# EAGLE design Crumar_D9U_Main (EAGLE 6.4)
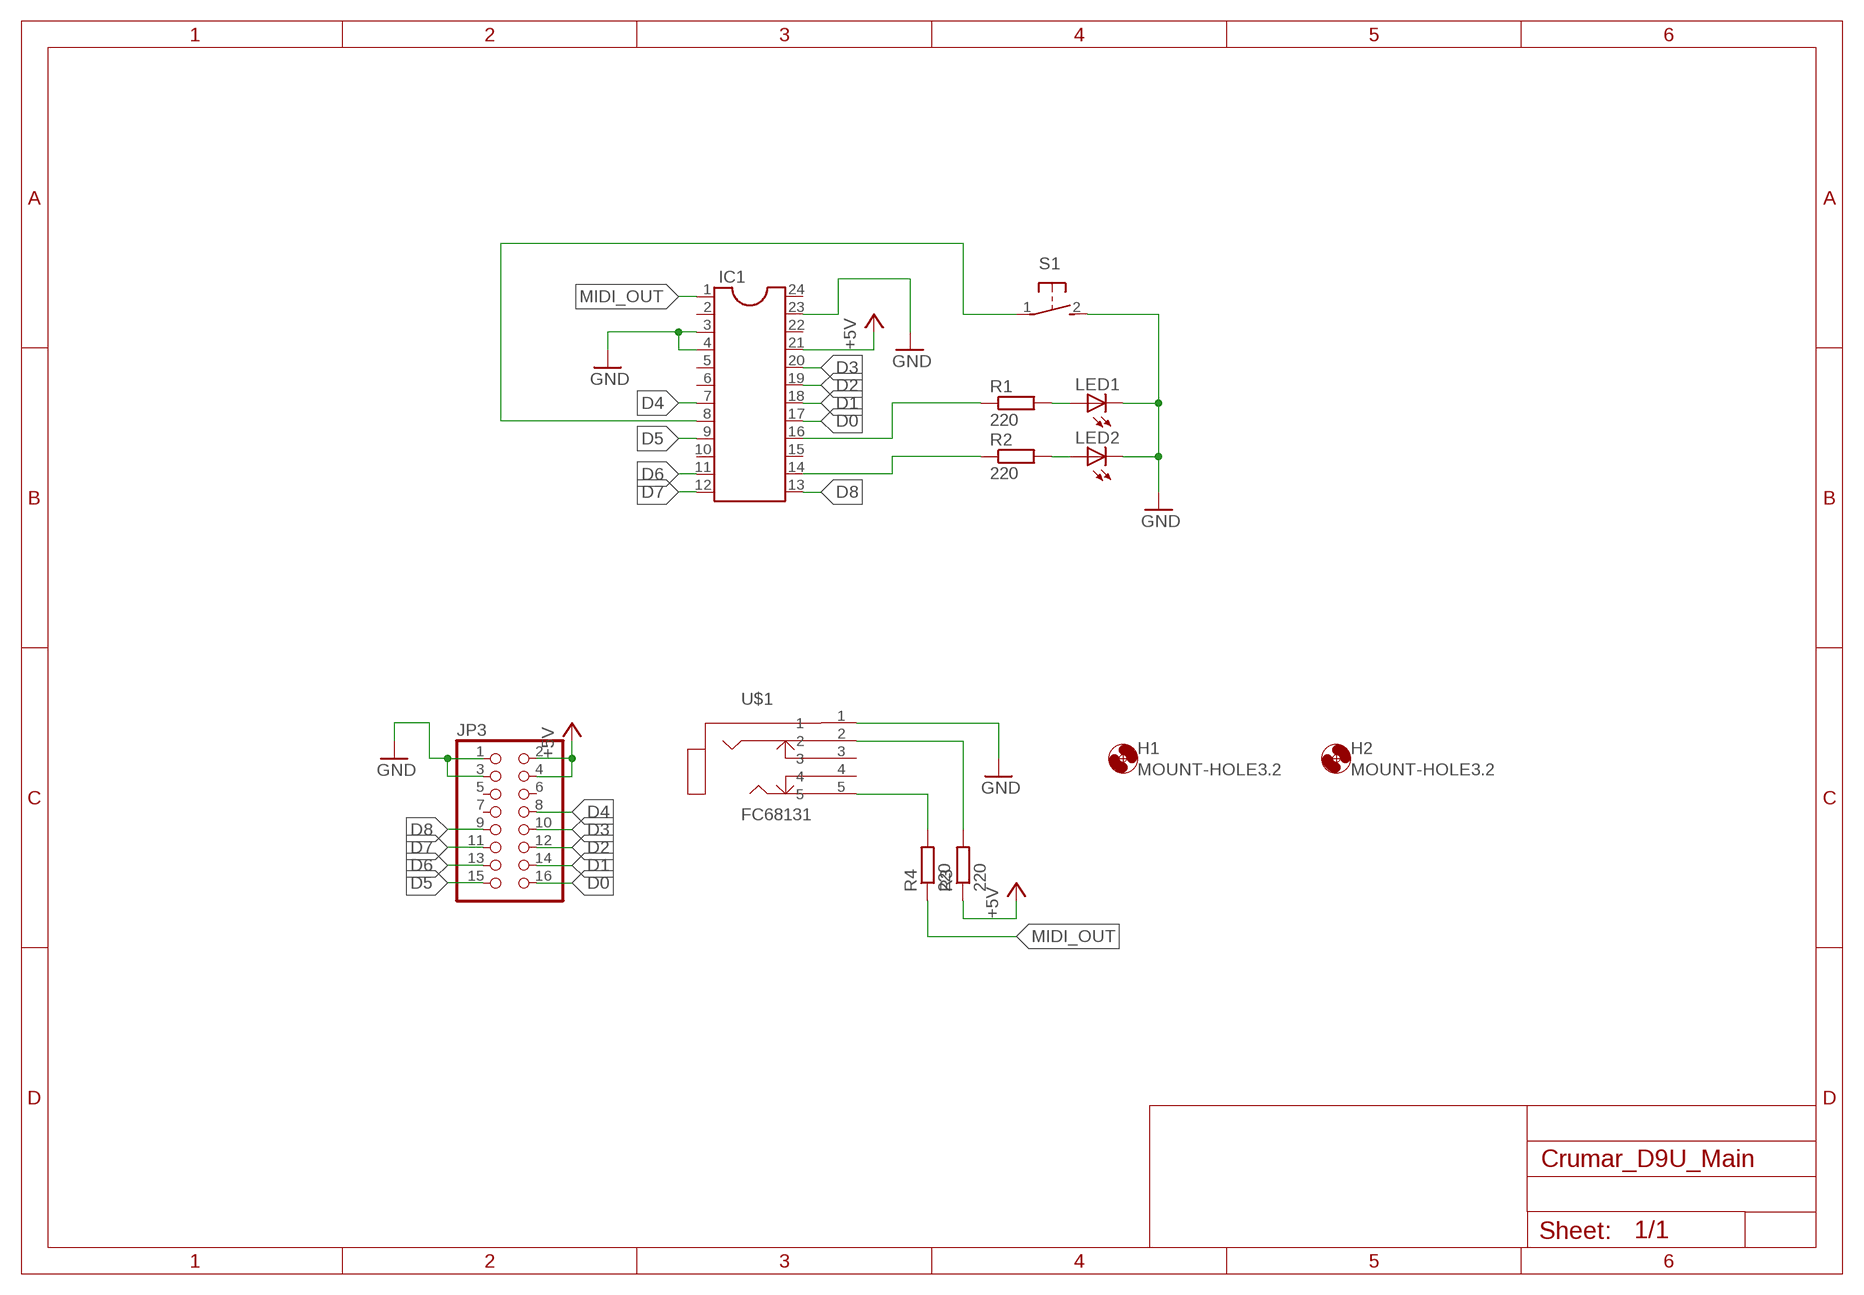
[diagram p0: schematic, sheet 1]

## Parts
H1  MOUNT-HOLE3.2  [3,2]
H2  MOUNT-HOLE3.2  [3,2]
IC1  DIL24-6  [DIL24-6]
JP3  PINHD-2X8  [2X08]
LED1  LED3MM  [LED3MM]
LED2  LED3MM  [LED3MM]
R1  220  R-EU_0207/7  [0207/7]
R2  220  R-EU_0207/7  [0207/7]
R3  220  R-EU_0207/7  [0207/7]
R4  220  R-EU_0207/7  [0207/7]
S1  31-XX  [B3F-31XX]
U$1  FC68131  [FC68131-5P]

## Nets
+5V: IC1.21 JP3.2 JP3.4 R3.1
D0: IC1.17 JP3.16
D1: IC1.18 JP3.14
D2: IC1.19 JP3.12
D3: IC1.20 JP3.10
D4: IC1.7 JP3.8
D5: IC1.9 JP3.15
D6: IC1.11 JP3.13
D7: IC1.12 JP3.11
D8: IC1.13 JP3.9
GND: IC1.3 IC1.4 IC1.23 JP3.1 JP3.3 LED1.K(C) LED2.K(C) S1.2(S) U$1.1
LED1: IC1.16 R1.1
LED2: IC1.14 R2.1
MIDI_OUT: IC1.1 R4.1
N$1: LED2.A R2.2
N$2: LED1.A R1.2
N$4: R3.2 U$1.2
N$5: R4.2 U$1.5
SW: IC1.8 S1.1(P)
Unconnected: IC1.2 IC1.5 IC1.6 IC1.10 IC1.15 IC1.22 IC1.24 JP3.5 JP3.6 JP3.7 U$1.3 U$1.4

## Library data of the parts
H1 H2 = holes:MOUNT-HOLE: MOUNTING HOLE with drill center marker
IC1 = ic-package:DIL24: Dual In Line
JP3 = pinhead:PINHD-2X8: PIN HEADER
LED1 LED2 = led:LED: LED OSRAM: - CHIPLED LG R971, LG N971, LY N971, LG Q971, LY Q971, LO R971, LY R971 LH N974, LH R974 LS Q976, LO Q976, LY Q976 LO Q996 - Hyper CHIPLED LW Q18S LB Q993, LB Q99A, LB R99A - SideLED LS A670, LO A670, LY A670, LG A670, LP A670 LB A673, LV A673, LT A673, LW A673 LH A674 LY A675 LS A676, LA A676, LO A676, LY A676, LW A676 LS A679, LY A679, LG A679 - Hyper Micro SIDELED® LS Y876, LA Y876, LO Y876, LY Y876 LT Y87S - SmartLED LW L88C, LW L88S LB L89C, LB L89S, LG L890 LS L89K, LO L89K, LY L89K LS L896, LA L896, LO L896, LY L896 - TOPLED LS T670, LO T670, LY T670, LG T670, LP T670 LSG T670, LSP T670, LSY T670, LOP T670, LYG T670 LG T671, LOG T671, LSG T671 LB T673, LV T673, LT T673, LW T673 LH T674 LS T676, LA T676, LO T676, LY T676, LB T676, LH T676, LSB T676, LW T676 LB T67C, LV T67C, LT T67C, LS T67K, LO T67K, LY T67K, LW E67C LS E67B, LA E67B, LO E67B, LY E67B, LB E67C, LV E67C, LT E67C LW T67C LS T679, LY T679, LG T679 LS T770, LO T770, LY T770, LG T770, LP T770 LB T773, LV T773, LT T773, LW T773 LH T774 LS E675, LA E675, LY E675, LS T675 LS T776, LA T776, LO T776, LY T776, LB T776 LHGB T686 LT T68C, LB T68C - Hyper Mini TOPLED® LB M676 - Mini TOPLED Santana® LG M470 LS M47K, LO M47K, LY M47K Source: http://www.osram.convergy.de LUXEON: - LUMILED® LXK2-PW12-R00, LXK2-PW12-S00, LXK2-PW14-U00, LXK2-PW14-V00 LXK2-PM12-R00, LXK2-PM12-S00, LXK2-PM14-U00 LXK2-PE12-Q00, LXK2-PE12-R00, LXK2-PE12-S00, LXK2-PE14-T00, LXK2-PE14-U00 LXK2-PB12-K00, LXK2-PB12-L00, LXK2-PB12-M00, LXK2-PB14-N00, LXK2-PB14-P00, LXK2-PB14-Q00 LXK2-PR12-L00, LXK2-PR12-M00, LXK2-PR14-Q00, LXK2-PR14-R00 LXK2-PD12-Q00, LXK2-PD12-R00, LXK2-PD12-S00 LXK2-PH12-R00, LXK2-PH12-S00 LXK2-PL12-P00, LXK2-PL12-Q00, LXK2-PL12-R00 Source: www.luxeon.com KINGBRIGHT: KA-3528ASYC Source: www.kingbright.com
R1-R4 = rcl:R-EU_: RESISTOR, European symbol
S1 = switch-omron:31-XX: OMRON SWITCH; MPN: B3F-3100; OC_FARNELL: 959704; OC_NEWARK: 36M3582
U$1 = con-cliff:FC68131

## Board
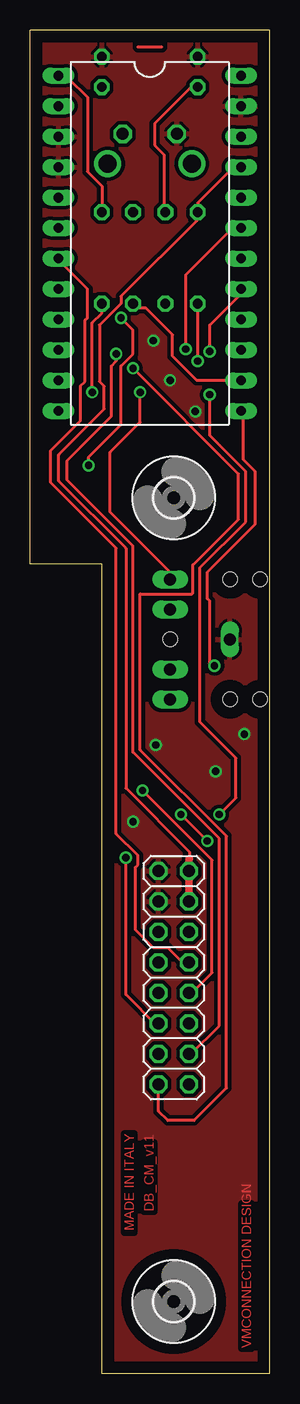
[diagram p1: board, top side]
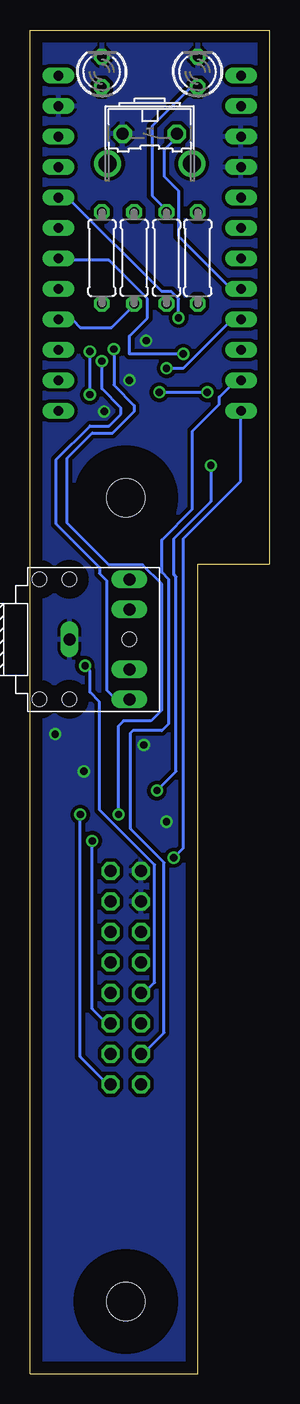
[diagram p2: board, bottom side, seen from below]

Size 20 x 112 mm. Coordinates in mm from the lower left corner, seen from the top.
Outline: 20,0 20,112 0,112 0,67.5 6,67.5 6,0 20,0
Copper layers (1*16): Top 0.035mm / dielectric 1.5mm / Bottom 0.035mm
Design rules "default": minimum track width 10mil, minimum drill 24mil, track to track 8mil, track to pad 8mil, pad to pad 8mil, via to via 8mil, smd to smd 8mil, copper to edge 40mil, drill to drill 8mil, minimum pad ring 10mil, minimum via ring 8mil, stop-mask expansion 4mil, vias tented up to drill 0mil, thermal gap 10mil

### Footprints (pad centres in the part's own frame; a part is rotated, then mirrored left to right if it is on the bottom)
3,2 = hole 3.2: 0,0
DIL24-6 = drill 0.813 long: 1 -13.97,-7.62; 2 -11.43,-7.62; 3 -8.89,-7.62; 4 -6.35,-7.62; 5 -3.81,-7.62; 6 -1.27,-7.62; 7 1.27,-7.62; 8 3.81,-7.62; 9 6.35,-7.62; 10 8.89,-7.62; 11 11.43,-7.62; 12 13.97,-7.62; 13 13.97,7.62; 14 11.43,7.62; 15 8.89,7.62; 16 6.35,7.62; 17 3.81,7.62; 18 1.27,7.62; 19 -1.27,7.62; 20 -3.81,7.62; 21 -6.35,7.62; 22 -8.89,7.62; 23 -11.43,7.62; 24 -13.97,7.62
2X08 = drill 1.016 octagon: 1 -8.89,-1.27; 2 -8.89,1.27; 3 -6.35,-1.27; 4 -6.35,1.27; 5 -3.81,-1.27; 6 -3.81,1.27; 7 -1.27,-1.27; 8 -1.27,1.27; 9 1.27,-1.27; 10 1.27,1.27; 11 3.81,-1.27; 12 3.81,1.27; 13 6.35,-1.27; 14 6.35,1.27; 15 8.89,-1.27; 16 8.89,1.27
LED3MM = drill 0.813 octagon: A -1.27,0; K 1.27,0
0207/7 = drill 0.813 octagon: 1 -3.81,0; 2 3.81,0
B3F-31XX = drill 1.016 octagon: 1 -2.261,-1.245; 2 2.261,-1.245 | drill 1.499 pad 2.159: 3 -3.505,1.245; 4 3.505,1.245
FC68131-5P = drill 1 long: 1 -5,0; 2 0,-5; 3 0,-2.5; 4 0,2.5; 5 0,5 | hole 1.2: 0,0; -5,-5; -5,5; -7.5,5; -7.5,-5

### Placement (x,y rotation side)
H1  12,73 0 top
H2  12,6 0 top
IC1  10,94.22 270 top
JP3  12,33 270 top
LED1  14,108.51 90 bottom
LED2  6,108.51 90 bottom
R1  11.3,93 90 bottom
R2  8.6,93 90 bottom
R3  14,93 270 bottom
R4  6,93 270 bottom
S1  10,102.1 180 bottom
U$1  11.7,61.2 0 bottom

### Tracks (layer width: path | path; a pad name or v marks a point on that pad's centre or on a via)
+5V
  Top 0.254: IC1.21 17.6,100.4 16.8,100.4 14,97.6 R3.1 14,96.2 7.6,89.8 7.6,89.2 5.8,87.4 5.8,82.7 6.2,82.3 6.2,80.4 2.4,76.6 2.4,74.4 8,68.8 8,48.8 13.3,43.5 13.3,42.9
  Top 0.61: 13.3,42.9 13.27,42.87 JP3.2 JP3.4
D0  (via drill 0.61)
  Top 0.254: v15,85.2 15,87.4 17.6,90 17.6,90.4 IC1.17 | v15,81.6 15,78.2 18,75.2 18,71 14.2,67.2 14.2,54.3 17.2,51.3 17.2,48 v15.8,46.6
  Bottom 0.254: v15,81.6 v15,85.2 | v15.8,46.6 15.8,26.4 13.4,24 JP3.16
D1  (via drill 0.61)
  Top 0.254: v7.2,85 7.2,84.4 6.8,84 6.8,79.8 3.1,76.1 3.1,74.5 8.6,69 8.6,51.8 15.8,44.6 15.8,29 13.4,26.6 JP3.14
  Bottom 0.254: IC1.18 17.6,92.8 13.4,92.8 10.2,89.6 10.2,88 11.7,86.5 11.7,85 v7.2,85
D2  (via drill 0.61)
  Top 0.254: v13,85.4 13,91.6 16.8,95.4 17.6,95.4 IC1.19 | v14.8,44.4 v12.6,46.6
  Bottom 0.254: v14.8,44.4 14.8,30.4 13.4,29 JP3.12 | v12.6,46.6 12.6,54 12.2,54.4 9.9,54.4 9,55.3 9,65.8 10.6,67.4 13.4,67.4 16.9,70.9 16.9,76.3 14.8,78.4 13.1,78.4 11.3,80.2 11.3,80.7 13,82.4 v13,85.4
D3  (via drill 0.61)
  Top 0.254: v7.6,88 8.6,87 8.6,85 7.6,84 7.6,79.1 4.9,76.4 v4.9,75.7 | v9.4,48.6 15.2,42.8 15.2,33.4 13.4,31.6 JP3.10
  Bottom 0.254: v7.6,88 7.6,89.6 8.2,90.2 9,90.2 16.8,98 17.6,98 IC1.20 | v9.4,48.6 7.8,50.2 7.8,66.4 8,66.6 8,69.6 4.9,72.7 v4.9,75.7
D4
  Top 0.254: IC1.7 2.4,92.8 4.8,90.4 4.8,88 4.6,87.8 4.6,82.7 4.2,82.3 4.2,79.4 1.7,76.9 1.7,74.3 7.2,68.8 7.2,45 9,43.2 9,42.4 8.8,42.2 8.8,37 10.3,35.5 11.5,35.5 12.6,34.4 13.2,34.4 JP3.8
D5  (via drill 0.61)
  Top 0.254: v8.6,83.8 17.4,75 17.4,71.2 13.6,67.4 13.6,65.1 arc-90 13.5,65 9.2,65 9.2,52 16.4,44.8 16.4,23.8 13.7,21.1 11.5,21.1 10.73,21.87 JP3.15
  Bottom 0.254: v8.6,83.8 7.2,83.8 3.2,87.8 2.4,87.8 IC1.9
D6
  Bottom 0.254: 2.4,82.8 IC1.11 2.91,82.79 2.91,82.69 4.2,81.4 4.2,80.8 6.45,78.55 6.45,72.05 9,69.5 9,66.8 8.4,66.2 8.4,54.2 9,53.6 11.4,53.6 11.6,53.4 11.6,45.4 8.8,42.6 8.8,28.4 10.6,26.6 JP3.13
D7  (via drill 0.61)
  Top 0.254: v8,43 8,31.6 10.6,29 JP3.11
  Bottom 0.254: v8,43 7.2,43.8 7.2,69.6 2.4,74.4 2.4,80.2 IC1.12
D8  (via drill 0.61)
  Top 0.254: v15.4,59 15,59 15,64.4 14.8,64.6 14.8,66.8 18.8,70.8 18.8,75.2 17.8,76.2 17.8,80.2 IC1.13
  Bottom 0.254: JP3.9 10.6,31.6 9.6,32.6 9.6,42.4 14.2,47 14.2,56 15,56.8 15,58.6 v15.4,59
GND  (via drill 0.61)
  other vias: 10.3,86.1 11.7,82.8 8.6,46 10.5,52.4 15.5,50.2 17.9,53.3 13.8,80.2
  pour Top (isolate 0.305): 0,0.08 20.32,0.08 20.32,111.84 0,111.84
  pour Bottom (isolate 0.305): 0,0.08 20.32,0.08 20.32,111.84 0,111.84
LED1
  Bottom 0.254: R1.1 11.4,89 13.2,87.2 15.8,87.2 16.4,87.8 17.6,87.8 IC1.16
LED2
  Top 0.254: IC1.14 17.6,82.8 13.9,82.8 11.9,84.8 11.9,86.6 9.7,88.8 8.99,88.8 R2.1
MIDI_OUT
  Top 0.254: R4.1 6,99 4.8,100.2 4.8,106.4 3.2,108 2.4,108 IC1.1
N$1
  Bottom 0.254: R2.2 8.6,97 9.8,98.2 9.8,104 6.6,107.2 6,107.2 LED2.A
N$2
  Top 0.254: R1.2 11.2,97 11.2,101.6 10.4,102.4 10.4,104.2 13.4,107.2 14,107.2 LED1.A
N$3
  Top 0.254: 11,110.57 9,110.57
N$4  (via drill 0.61)
  Top 0.254: v14,84.4 R3.2
  Bottom 0.254: v14,84.4 14,82.1 12.4,80.5 12.4,80 13.4,79 15,79 17.8,76.2 17.8,70.8 14.2,67.2 14.2,66.7 13.6,66.1 13.6,57 12.8,56.2 U$1.2
N$5  (via drill 0.61)
  Top 0.254: R4.2 6,88.4 5.2,87.6 v5.2,81.8 | U$1.5 11.7,66.8 6.7,71.8 6.7,76.8 9.2,79.3 v9.2,81.8
  Bottom 0.254: v9.2,81.8 v5.2,81.8
SW
  Bottom 0.254: IC1.8 2.4,90.6 3.4,90.6 7.6,94.8 7.6,98.6 8.8,99.8 8.8,102 7.6,103.2 S1.1

### Text on the board
Top: MADE IN ITALY | DB_CM_v11 | VMCONNECTION DESIGN